# Altium project Reid Orthotic v2.PrjPcb
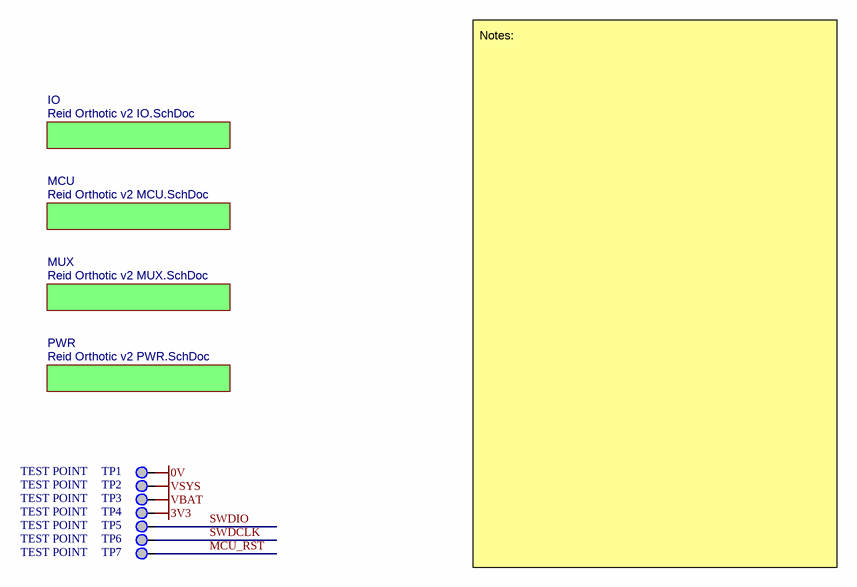
[diagram p0: Reid Orthotic v2.SchDoc]
5 sheets, 127 parts. Net scope: global (net labels, ports and power ports of the same name join across sheets).
Sheets:
  Reid Orthotic v2.SchDoc
    IO = Reid Orthotic v2 IO.SchDoc
    MCU = Reid Orthotic v2 MCU.SchDoc
    MUX = Reid Orthotic v2 MUX.SchDoc
    PWR = Reid Orthotic v2 PWR.SchDoc

## Sheet Reid Orthotic v2.SchDoc: CAL1020
size A4; DrawnBy: Alex Gilmour; DocumentNumber: 1; Revision: v2; SheetNumber: 1; SheetTotal: 5; PageSetup: Record=PageOptions|CenterHorizontal=True|CenterVertical=True|PrintScale=0.73|XCorrection=1.00|YCorrection=1.00|PrintKind=0|BorderSize=5000000|LeftOffset=0|BottomOffset=0|Orientation=2|PaperLength=1000|PaperWidth=1000|Scale=100|PaperSource=7|PrintQuality=-3|MediaType=1|DitherType=10|PrintScaleMode=1|PaperKind=A4|PaperIndex=9

### Parts
TP1  TEST POINT  [TEST POINT 1.0MM]  (no BOM)
TP2  TEST POINT  [TEST POINT 1.0MM]  (no BOM)
TP3  TEST POINT  [TEST POINT 1.0MM]  (no BOM)
TP4  TEST POINT  [TEST POINT 1.0MM]  (no BOM)
TP5  TEST POINT  [TEST POINT 1.0MM]  (no BOM)
TP6  TEST POINT  [TEST POINT 1.0MM]  (no BOM)
TP7  TEST POINT  [TEST POINT 1.0MM]  (no BOM)

### Sub-sheets
IO = Reid Orthotic v2 IO.SchDoc: no entries
MCU = Reid Orthotic v2 MCU.SchDoc: no entries
MUX = Reid Orthotic v2 MUX.SchDoc: no entries
PWR = Reid Orthotic v2 PWR.SchDoc: no entries

### Nets
0V: TP1.TP
3V3: TP4.TP
VBAT: TP3.TP
VSYS: TP2.TP
MCU_RST: TP7.TP
SWDCLK: TP6.TP
SWDIO: TP5.TP

### Notes on the sheet
- Notes:
- A.B.N. 89 367 394 425
- Revision
- Drawn by
- Last updated
- Sheet
- of

## Sheet Reid Orthotic v2 IO.SchDoc: CAL1020 IO
size A4; DrawnBy: Alex Gilmour; DocumentNumber: 2; Revision: v2; SheetNumber: 2; SheetTotal: 5; PageSetup: Record=PageOptions|CenterHorizontal=True|CenterVertical=True|PrintScale=0.73|XCorrection=1.00|YCorrection=1.00|PrintKind=0|BorderSize=5000000|LeftOffset=0|BottomOffset=0|Orientation=2|PaperLength=1000|PaperWidth=1000|Scale=100|PaperSource=7|PrintQuality=-3|MediaType=1|DitherType=10|PrintScaleMode=1|PaperKind=A4|PaperIndex=9
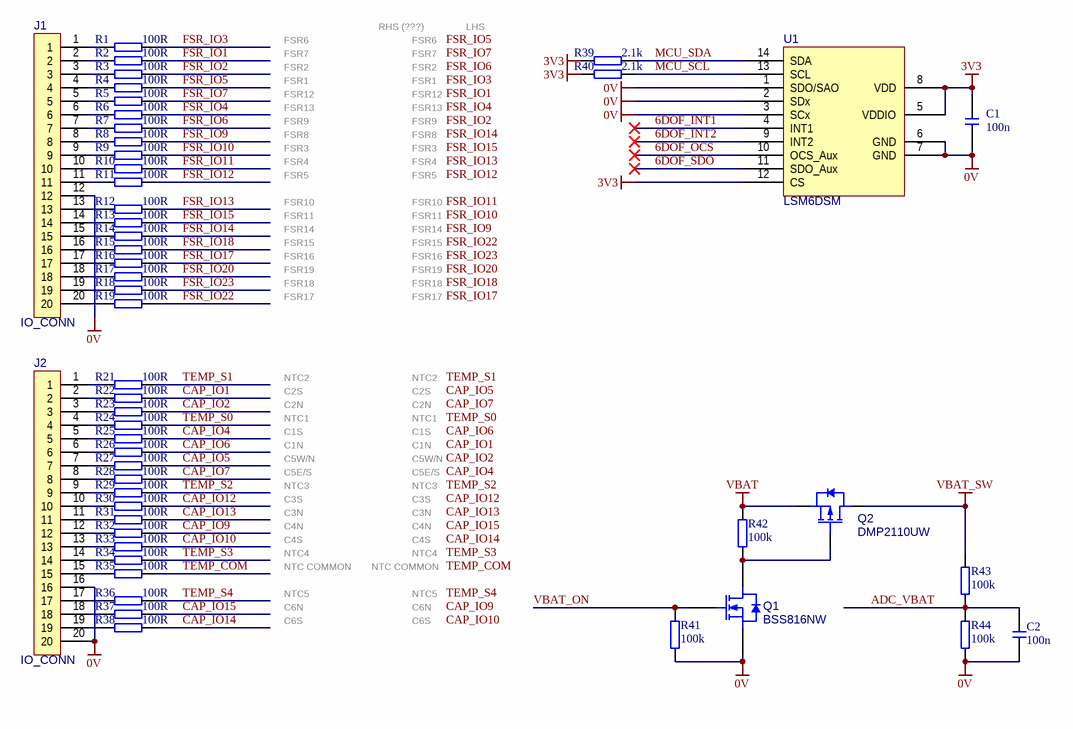
[diagram p1: Reid Orthotic v2 IO.SchDoc]

### Parts
C1  100n  [0402 CAP HD]
C2  100n  [0402 CAP HD]
J1  IO_CONN  [IO_CONN]
J2  IO_CONN  [IO_CONN]
Q1  BSS816NW  [SOT323]
Q2  DMP2110UW  [SOT323]
R1  100R  [0402 RES HD]
R2  100R  [0402 RES HD]
R3  100R  [0402 RES HD]
R4  100R  [0402 RES HD]
R5  100R  [0402 RES HD]
R6  100R  [0402 RES HD]
R7  100R  [0402 RES HD]
R8  100R  [0402 RES HD]
R9  100R  [0402 RES HD]
R10  100R  [0402 RES HD]
R11  100R  [0402 RES HD]
R12  100R  [0402 RES HD]
R13  100R  [0402 RES HD]
R14  100R  [0402 RES HD]
R15  100R  [0402 RES HD]
R16  100R  [0402 RES HD]
R17  100R  [0402 RES HD]
R18  100R  [0402 RES HD]
R19  100R  [0402 RES HD]
R21  100R  [0402 RES HD]
R22  100R  [0402 RES HD]
R23  100R  [0402 RES HD]
R24  100R  [0402 RES HD]
R25  100R  [0402 RES HD]
R26  100R  [0402 RES HD]
R27  100R  [0402 RES HD]
R28  100R  [0402 RES HD]
R29  100R  [0402 RES HD]
R30  100R  [0402 RES HD]
R31  100R  [0402 RES HD]
R32  100R  [0402 RES HD]
R33  100R  [0402 RES HD]
R34  100R  [0402 RES HD]
R35  100R  [0402 RES HD]
R36  100R  [0402 RES HD]
R37  100R  [0402 RES HD]
R38  100R  [0402 RES HD]
R39  2.1k  [0402 RES HD]
R40  2.1k  [0402 RES HD]
R41  100k  [0402 RES HD]
R42  100k  [0402 RES HD]
R43  100k  [0402 RES HD]
R44  100k  [0402 RES HD]
U1  LSM6DSM  [LSM6DSM]

### Nets
0V: C1.1 C2.2 J1.12 J2.16 J2.20 Q1.2(S) R41.2 R44.2 U1.1(SDO/SAO) U1.2(SDx) U1.3(SCx) U1.6(GND) U1.7(GND)
3V3: C1.2 R39.2 R40.2 U1.5(VDDIO) U1.8(VDD) U1.12(CS)
VBAT: Q2.2(S) R42.1
VBAT_SW: Q2.3(D) R43.1
6DOF_INT1: U1.4(INT1)
6DOF_INT2: U1.9(INT2)
6DOF_OCS: U1.10(OCS_Aux)
6DOF_SDO: U1.11(SDO_Aux)
ADC_VBAT: C2.1 R43.2 R44.1
CAP_IO1: R22.1
CAP_IO2: R23.1
CAP_IO4: R25.1
CAP_IO5: R27.1
CAP_IO6: R26.1
CAP_IO7: R28.1
CAP_IO9: R32.1
CAP_IO10: R33.1
CAP_IO12: R30.1
CAP_IO13: R31.1
CAP_IO14: R38.1
CAP_IO15: R37.1
FSR_IO1: R2.1
FSR_IO2: R3.1
FSR_IO3: R1.1
FSR_IO4: R6.1
FSR_IO5: R4.1
FSR_IO6: R7.1
FSR_IO7: R5.1
FSR_IO9: R8.1
FSR_IO10: R9.1
FSR_IO11: R10.1
FSR_IO12: R11.1
FSR_IO13: R12.1
FSR_IO14: R14.1
FSR_IO15: R13.1
FSR_IO17: R16.1
FSR_IO18: R15.1
FSR_IO20: R17.1
FSR_IO22: R19.1
FSR_IO23: R18.1
MCU_SCL: R40.1 U1.13(SCL)
MCU_SDA: R39.1 U1.14(SDA)
TEMP_COM: R35.1
TEMP_S0: R24.1
TEMP_S1: R21.1
TEMP_S2: R29.1
TEMP_S3: R34.1
TEMP_S4: R36.1
VBAT_ON: Q1.1(G) R41.1
NetJ1_1: J1.1 R1.2
NetJ1_2: J1.2 R2.2
NetJ1_3: J1.3 R3.2
NetJ1_4: J1.4 R4.2
NetJ1_5: J1.5 R5.2
NetJ1_6: J1.6 R6.2
NetJ1_7: J1.7 R7.2
NetJ1_8: J1.8 R8.2
NetJ1_9: J1.9 R9.2
NetJ1_10: J1.10 R10.2
NetJ1_11: J1.11 R11.2
NetJ1_13: J1.13 R12.2
NetJ1_14: J1.14 R13.2
NetJ1_15: J1.15 R14.2
NetJ1_16: J1.16 R15.2
NetJ1_17: J1.17 R16.2
NetJ1_18: J1.18 R17.2
NetJ1_19: J1.19 R18.2
NetJ1_20: J1.20 R19.2
NetJ2_1: J2.1 R21.2
NetJ2_2: J2.2 R22.2
NetJ2_3: J2.3 R23.2
NetJ2_4: J2.4 R24.2
NetJ2_5: J2.5 R25.2
NetJ2_6: J2.6 R26.2
NetJ2_7: J2.7 R27.2
NetJ2_8: J2.8 R28.2
NetJ2_9: J2.9 R29.2
NetJ2_10: J2.10 R30.2
NetJ2_11: J2.11 R31.2
NetJ2_12: J2.12 R32.2
NetJ2_13: J2.13 R33.2
NetJ2_14: J2.14 R34.2
NetJ2_15: J2.15 R35.2
NetJ2_17: J2.17 R36.2
NetJ2_18: J2.18 R37.2
NetJ2_19: J2.19 R38.2
NetQ1_3: Q1.3(D) Q2.1(G) R42.2

### Notes on the sheet
- FSR1
- FSR2
- FSR6
- FSR7
- RHS (???)
- LHS
- FSR3
- FSR8
- FSR9
- FSR12
- FSR13
- FSR4
- FSR5
- FSR10
- FSR11
- FSR14
- FSR15
- FSR16
- FSR18
- FSR19
- FSR17
- NTC1
- NTC2
- C2S
- C2N
- NTC3
- C1S
- C1N
- C5W/N
- C5E/S
- NTC4
- C3S
- C3N
- C4N
- C4S
- NTC5
- NTC COMMON
- C6N
- C6S
- Labels drawn without touching a wire or pin: CAP_IO1, CAP_IO2, CAP_IO4, CAP_IO5, CAP_IO6, CAP_IO7, CAP_IO9, CAP_IO10, CAP_IO12, CAP_IO13, CAP_IO14, CAP_IO15, FSR_IO1, FSR_IO2, FSR_IO3, FSR_IO4, FSR_IO5, FSR_IO6, FSR_IO7, FSR_IO9, FSR_IO10, FSR_IO11, FSR_IO12, FSR_IO13, FSR_IO14, FSR_IO15, FSR_IO17, FSR_IO18, FSR_IO20, FSR_IO22, FSR_IO23, TEMP_COM, TEMP_S0, TEMP_S1, TEMP_S2, TEMP_S3, TEMP_S4
- A.B.N. 89 367 394 425
- Revision
- Drawn by
- Last updated
- Sheet
- of

### Library data of the parts
C1 C2 = Capacitor
Q1 = MOSFET N-CH
Q2 = MOSFET PCH
R1-R19 R21-R44 = Resistor

## Sheet Reid Orthotic v2 MCU.SchDoc: CAL1020 MCU
size A4; DrawnBy: Alex Gilmour; DocumentNumber: 3; Revision: v2; SheetNumber: 3; SheetTotal: 5; PageSetup: Record=PageOptions|CenterHorizontal=True|CenterVertical=True|PrintScale=0.73|XCorrection=1.00|YCorrection=1.00|PrintKind=0|BorderSize=5000000|LeftOffset=0|BottomOffset=0|Orientation=2|PaperLength=1000|PaperWidth=1000|Scale=100|PaperSource=7|PrintQuality=-3|MediaType=1|DitherType=10|PrintScaleMode=1|PaperKind=A4|PaperIndex=9
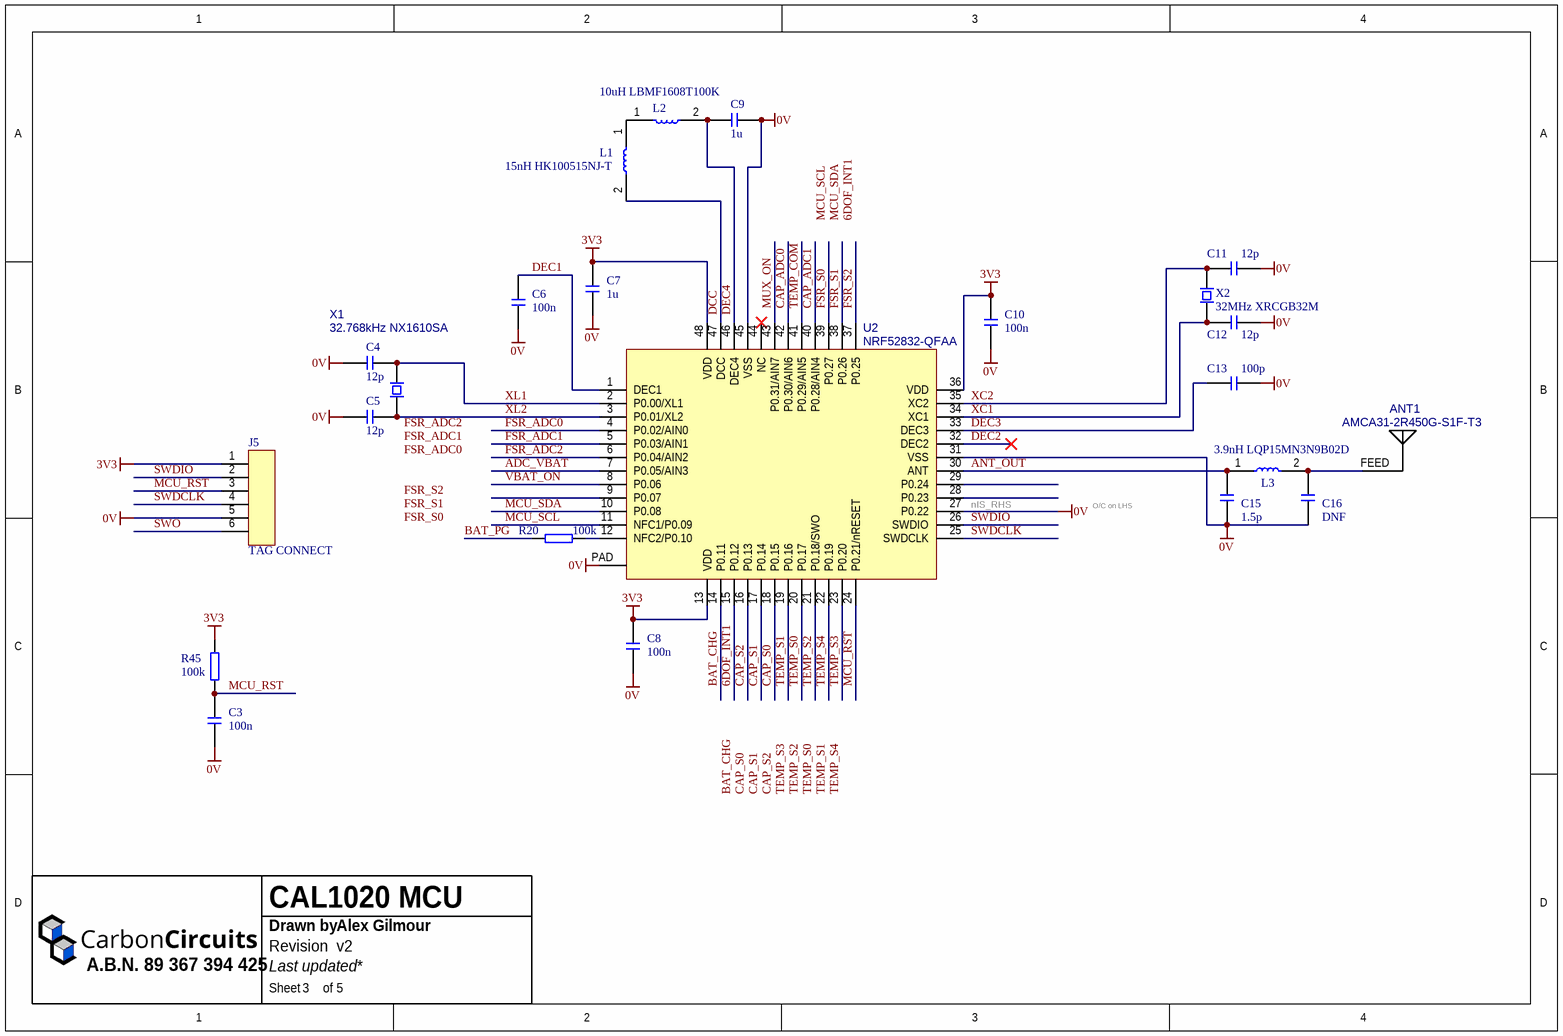
[diagram p2: Reid Orthotic v2 MCU.SchDoc]

### Parts
ANT1  AMCA31-2R450G-S1F-T3  [RFANT3216120A5T]
C3  100n  [0402 CAP HD]
C4  12p  [0402 CAP HD]
C5  12p  [0402 CAP HD]
C6  100n  [0402 CAP HD]
C7  1u  [0402 CAP HD]
C8  100n  [0402 CAP HD]
C9  1u  [0402 CAP HD]
C10  100n  [0402 CAP HD]
C11  12p  [0402 CAP HD]
C12  12p  [0402 CAP HD]
C13  100p  [0402 CAP HD]
C15  1.5p  [0402 CAP HD]
C16  DNF  [0402 CAP HD]
J5  TAG CONNECT  [TC2030-NL]  (no BOM)
L1  15nH HK100515NJ-T  [0402 HD]
L2  10uH LBMF1608T100K  [0603 HD]
L3  3.9nH LQP15MN3N9B02D  [0402 HD]
R20  100k  [0402 RES HD]
R45  100k  [0402 RES HD]
U2  NRF52832-QFAA  [NRF52832-QFAA]
X1  32.768kHz NX1610SA  [CRYSTAL NDK NX1610SA]
X2  32MHz XRCGB32M  [XTAL 2016]

### Nets
0V: C3.1 C4.2 C5.2 C6.1 C7.1 C8.1 C9.1 C10.1 C11.1 C12.1 C13.1 C15.1 C16.1 J5.5 U2.27(P0.22) U2.31(VSS) U2.45(VSS) U2.PAD
3V3: C7.2 C8.2 C10.2 J5.1 R45.2 U2.13(VDD) U2.36(VDD) U2.48(VDD)
6DOF_INT1: U2.15(P0.12)
ADC_VBAT: U2.7(P0.05/AIN3)
ANT_OUT: C15.2 L3.1 U2.30(ANT)
BAT_CHG: U2.14(P0.11)
BAT_PG: R20.2
CAP_ADC0: U2.42(P0.30/AIN6)
CAP_ADC1: U2.40(P0.28/AIN4)
CAP_S0: U2.18(P0.15)
CAP_S1: U2.17(P0.14)
CAP_S2: U2.16(P0.13)
DCC: L1.2 U2.47(DCC)
DEC1: C6.2 U2.1(DEC1)
DEC2: U2.32(DEC2)
DEC3: C13.2 U2.33(DEC3)
DEC4: C9.2 L2.2 U2.46(DEC4)
FSR_ADC0: U2.4(P0.02/AIN0)
FSR_ADC1: U2.5(P0.03/AIN1)
FSR_ADC2: U2.6(P0.04/AIN2)
FSR_S0: U2.39(P0.27)
FSR_S1: U2.38(P0.26)
FSR_S2: U2.37(P0.25)
MCU_RST: C3.2 J5.3 R45.1 U2.24(P0.21/nRESET)
MCU_SCL: U2.11(NFC1/P0.09)
MCU_SDA: U2.10(P0.08)
MUX_ON: U2.43(P0.31/AIN7)
SWDCLK: J5.4 U2.25(SWDCLK)
SWDIO: J5.2 U2.26(SWDIO)
SWO: J5.6
TEMP_COM: U2.41(P0.29/AIN5)
TEMP_S0: U2.20(P0.17)
TEMP_S1: U2.19(P0.16)
TEMP_S2: U2.21(P0.18/SWO)
TEMP_S3: U2.23(P0.20)
TEMP_S4: U2.22(P0.19)
VBAT_ON: U2.8(P0.06)
XC1: C12.2 U2.34(XC1) X2.1
XC2: C11.2 U2.35(XC2) X2.2
XL1: C4.1 U2.2(P0.00/XL1) X1.1
XL2: C5.1 U2.3(P0.01/XL2) X1.2
NetANT1_FEED: ANT1.FEED C16.2 L3.2
NetL1_1: L1.1 L2.1
NetR20_1: R20.1 U2.12(NFC2/P0.10)

Not connected (* = marked no-connect by the designer): U2 9(P0.07) 28(P0.23) 29(P0.24) 44(NC)*

### Notes on the sheet
- (near U2) nIS_RHS
- O/C on LHS
- Labels drawn without touching a wire or pin: 6DOF_INT1, BAT_CHG, CAP_S0, CAP_S1, CAP_S2, FSR_ADC0, FSR_ADC1, FSR_ADC2, FSR_S0, FSR_S1, FSR_S2, MCU_SCL, MCU_SDA, TEMP_S0, TEMP_S1, TEMP_S2, TEMP_S3, TEMP_S4
- A.B.N. 89 367 394 425
- Revision
- Drawn by
- Last updated
- Sheet
- of

### Library data of the parts
ANT1 = Antenna
C3-C13 C15 C16 = Capacitor
J5 = CON 6POS
L1-L3 = Inductor
R20 R45 = Resistor
X1 = Crystal 32.768kHz
X2 = Crystal

## Sheet Reid Orthotic v2 MUX.SchDoc: CAL1020 MCU
size A4; DrawnBy: Alex Gilmour; DocumentNumber: 4; Revision: v2; SheetNumber: 4; SheetTotal: 5; PageSetup: Record=PageOptions|CenterHorizontal=True|CenterVertical=True|PrintScale=0.73|XCorrection=1.00|YCorrection=1.00|PrintKind=0|BorderSize=5000000|LeftOffset=0|BottomOffset=0|Orientation=2|PaperLength=1000|PaperWidth=1000|Scale=100|PaperSource=7|PrintQuality=-3|MediaType=1|DitherType=10|PrintScaleMode=1|PaperKind=A4|PaperIndex=9
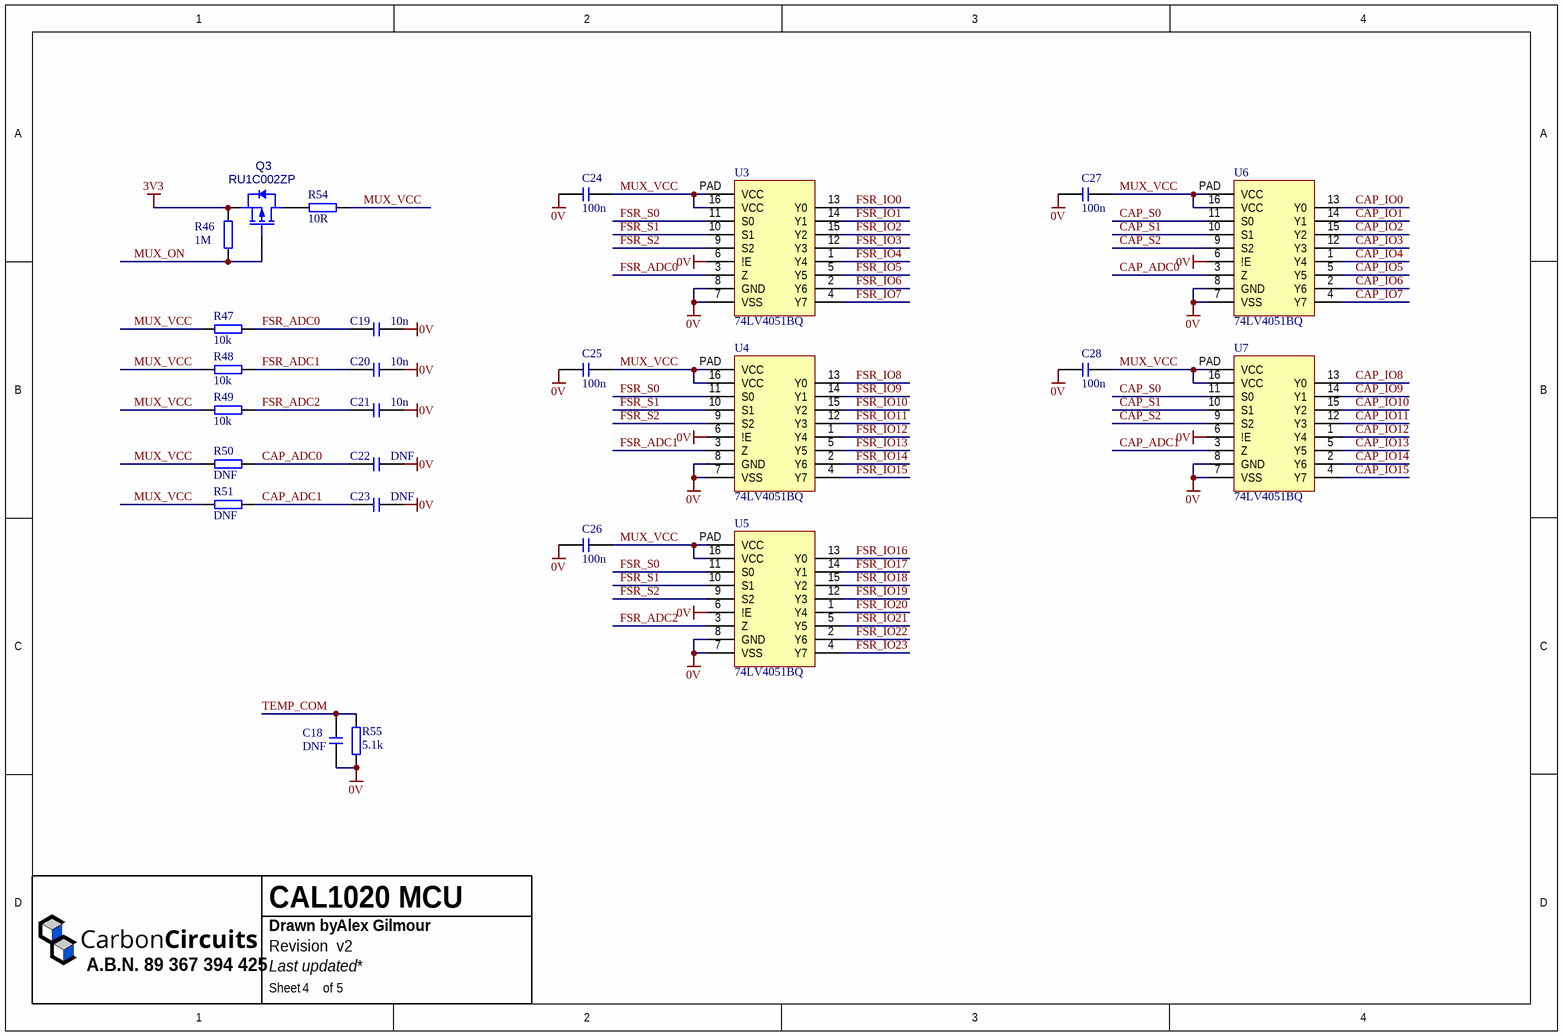
[diagram p3: Reid Orthotic v2 MUX.SchDoc]

### Parts
C18  DNF  [0402 CAP HD]
C19  10n  [0402 CAP HD]
C20  10n  [0402 CAP HD]
C21  10n  [0402 CAP HD]
C22  DNF  [0402 CAP HD]
C23  DNF  [0402 CAP HD]
C24  100n  [0402 CAP HD]
C25  100n  [0402 CAP HD]
C26  100n  [0402 CAP HD]
C27  100n  [0402 CAP HD]
C28  100n  [0402 CAP HD]
Q3  RU1C002ZP  [SOT323]
R46  1M  [0402 RES HD]
R47  10k  [0402 RES HD]
R48  10k  [0402 RES HD]
R49  10k  [0402 RES HD]
R50  DNF  [0402 RES HD]
R51  DNF  [0402 RES HD]
R54  10R  [0603 RES HD]
R55  5.1k  [0402 RES HD]
U3  74LV4051BQ  [74LV4051BQ]
U4  74LV4051BQ  [74LV4051BQ]
U5  74LV4051BQ  [74LV4051BQ]
U6  74LV4051BQ  [74LV4051BQ]
U7  74LV4051BQ  [74LV4051BQ]

### Nets
0V: C18.2 C19.2 C20.2 C21.2 C22.2 C23.2 C24.1 C25.1 C26.1 C27.1 C28.1 R55.2 U3.6(!E) U3.7(VSS) U3.8(GND) U4.6(!E) U4.7(VSS) U4.8(GND) U5.6(!E) U5.7(VSS) U5.8(GND) U6.6(!E) U6.7(VSS) U6.8(GND) U7.6(!E) U7.7(VSS) U7.8(GND)
3V3: Q3.2(S) R46.2
CAP_ADC0: C22.1 R50.1 U6.3(Z)
CAP_ADC1: C23.1 R51.1 U7.3(Z)
CAP_IO0: U6.13(Y0)
CAP_IO1: U6.14(Y1)
CAP_IO2: U6.15(Y2)
CAP_IO3: U6.12(Y3)
CAP_IO4: U6.1(Y4)
CAP_IO5: U6.5(Y5)
CAP_IO6: U6.2(Y6)
CAP_IO7: U6.4(Y7)
CAP_IO8: U7.13(Y0)
CAP_IO9: U7.14(Y1)
CAP_IO10: U7.15(Y2)
CAP_IO11: U7.12(Y3)
CAP_IO12: U7.1(Y4)
CAP_IO13: U7.5(Y5)
CAP_IO14: U7.2(Y6)
CAP_IO15: U7.4(Y7)
CAP_S0: U6.11(S0) U7.11(S0)
CAP_S1: U6.10(S1) U7.10(S1)
CAP_S2: U6.9(S2) U7.9(S2)
FSR_ADC0: C19.1 R47.1 U3.3(Z)
FSR_ADC1: C20.1 R48.1 U4.3(Z)
FSR_ADC2: C21.1 R49.1 U5.3(Z)
FSR_IO0: U3.13(Y0)
FSR_IO1: U3.14(Y1)
FSR_IO2: U3.15(Y2)
FSR_IO3: U3.12(Y3)
FSR_IO4: U3.1(Y4)
FSR_IO5: U3.5(Y5)
FSR_IO6: U3.2(Y6)
FSR_IO7: U3.4(Y7)
FSR_IO8: U4.13(Y0)
FSR_IO9: U4.14(Y1)
FSR_IO10: U4.15(Y2)
FSR_IO11: U4.12(Y3)
FSR_IO12: U4.1(Y4)
FSR_IO13: U4.5(Y5)
FSR_IO14: U4.2(Y6)
FSR_IO15: U4.4(Y7)
FSR_IO16: U5.13(Y0)
FSR_IO17: U5.14(Y1)
FSR_IO18: U5.15(Y2)
FSR_IO19: U5.12(Y3)
FSR_IO20: U5.1(Y4)
FSR_IO21: U5.5(Y5)
FSR_IO22: U5.2(Y6)
FSR_IO23: U5.4(Y7)
FSR_S0: U3.11(S0) U4.11(S0) U5.11(S0)
FSR_S1: U3.10(S1) U4.10(S1) U5.10(S1)
FSR_S2: U3.9(S2) U4.9(S2) U5.9(S2)
MUX_ON: Q3.1(G) R46.1
MUX_VCC: C24.2 C25.2 C26.2 C27.2 C28.2 R47.2 R48.2 R49.2 R50.2 R51.2 R54.1 U3.16(VCC) U3.PAD(VCC) U4.16(VCC) U4.PAD(VCC) U5.16(VCC) U5.PAD(VCC) U6.16(VCC) U6.PAD(VCC) U7.16(VCC) U7.PAD(VCC)
TEMP_COM: C18.1 R55.1
NetQ3_3: Q3.3(D) R54.2

### Notes on the sheet
- A.B.N. 89 367 394 425
- Revision
- Drawn by
- Last updated
- Sheet
- of

### Library data of the parts
C18-C28 = Capacitor
Q3 = MOSFET PCH
R46-R51 R54 R55 = Resistor

## Sheet Reid Orthotic v2 PWR.SchDoc: CAL1020 PWR
size A4; DrawnBy: Alex Gilmour; DocumentNumber: 5; Revision: v2; SheetNumber: 5; SheetTotal: 5; PageSetup: Record=PageOptions|CenterHorizontal=True|CenterVertical=True|PrintScale=0.73|XCorrection=1.00|YCorrection=1.00|PrintKind=0|BorderSize=5000000|LeftOffset=0|BottomOffset=0|Orientation=2|PaperLength=1000|PaperWidth=1000|Scale=100|PaperSource=7|PrintQuality=-3|MediaType=1|DitherType=10|PrintScaleMode=1|PaperKind=A4|PaperIndex=9
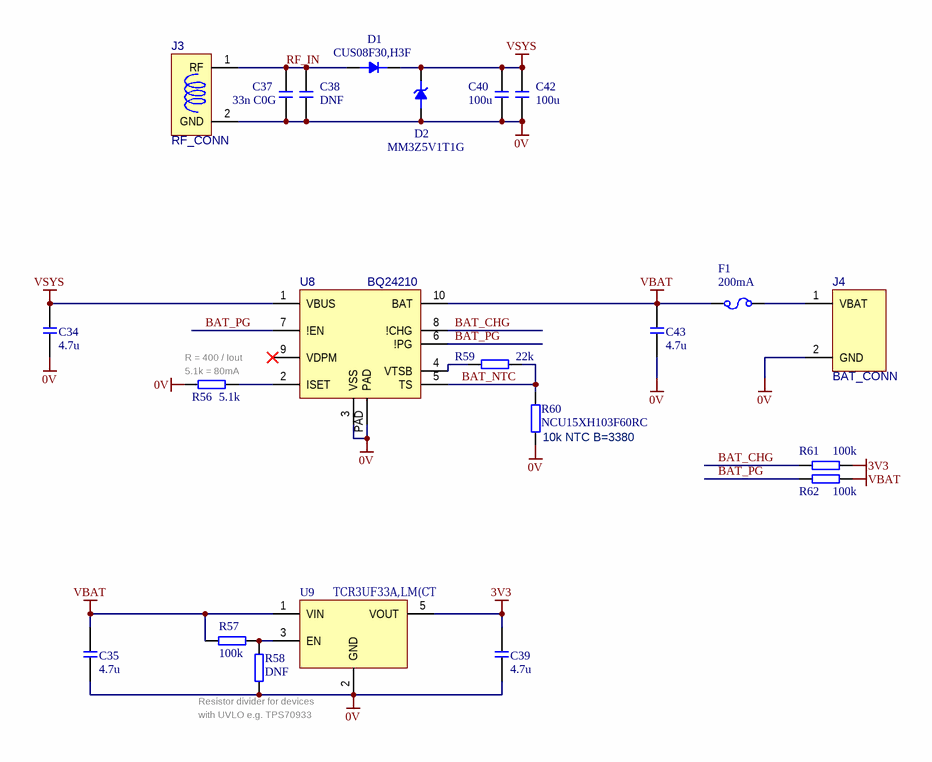
[diagram p4: Reid Orthotic v2 PWR.SchDoc]

### Parts
C34  4.7u  [0603 CAP HD]
C35  4.7u  [0603 CAP HD]
C37  33n C0G  [0805 CAP]
C38  DNF  [0805 CAP]
C39  4.7u  [0603 CAP HD]
C40  100u  [0805 CAP]
C42  100u  [0805 CAP]
C43  4.7u  [0603 CAP HD]
D1  CUS08F30,H3F  [SOD-323]
D2  MM3Z5V1T1G  [SOD-323]
F1  200mA  [0603 FUSE]
J3  RF_CONN  [RF_CONN]
J4  BAT_CONN  [BAT_CONN]
R56  5.1k  [0402 RES HD]
R57  100k  [0402 RES HD]
R58  DNF  [0402 RES HD]
R59  22k  [0402 RES HD]
R60  NCU15XH103F60RC  [0402 RES HD]
R61  100k  [0402 RES HD]
R62  100k  [0402 RES HD]
U8  BQ24210  [BQ24210]
U9  ‎TCR3UF33A,LM(CT  [SOT23-5]

### Nets
0V: C34.1 C35.1 C37.1 C38.1 C39.1 C40.1 C42.1 C43.1 D2.A J3.2(GND) J4.2(GND) R56.2 R58.2 R60.1 U8.3(VSS) U8.PAD U9.2(GND)
3V3: C39.2 R61.1 U9.5(VOUT)
VBAT: C35.2 C43.2 F1.2 R57.2 R62.1 U8.10(BAT) U9.1(VIN)
VSYS: C34.2 C40.2 C42.2 D1.K D2.K U8.1(VBUS)
BAT_CHG: R61.2 U8.8(!CHG)
BAT_NTC: R59.2 R60.2 U8.5(TS)
BAT_PG: R62.2 U8.6(!PG) U8.7(!EN)
RF_IN: C37.2 C38.2 D1.A J3.1(RF)
NetF1_1: F1.1 J4.1(VBAT)
NetR56_1: R56.1 U8.2(ISET)
NetR57_1: R57.1 R58.1 U9.3(EN)
NetR59_1: R59.1 U8.4(VTSB)

Not connected (* = marked no-connect by the designer): U8 9(VDPM)*

### Notes on the sheet
- (near R56) 5.1k = 80mA
- (near R56) R = 400 / Iout
- (near R60) 10k NTC B=3380
- (near R58) Resistor divider for devices
- with UVLO e.g. TPS70933
- A.B.N. 89 367 394 425
- Revision
- Drawn by
- Last updated
- Sheet
- of

### Library data of the parts
C34 C35 C37-C40 C42 C43 = Capacitor
D1 = Diode
D2 = Diode Zener
F1 = Fuse
R56-R62 = Resistor
U9 = MIC5504-x.xYM5

## Nets that join several sheets
0V: Reid Orthotic v2 (TP1.TP), Reid Orthotic v2 IO (13 pins), Reid Orthotic v2 MCU (18 pins), Reid Orthotic v2 MUX (27 pins), Reid Orthotic v2 PWR (17 pins)
3V3: Reid Orthotic v2 (TP4.TP), Reid Orthotic v2 IO (6 pins), Reid Orthotic v2 MCU (8 pins), Reid Orthotic v2 MUX (Q3.2 R46.2), Reid Orthotic v2 PWR (C39.2 R61.1 U9.5)
VBAT: Reid Orthotic v2 (TP3.TP), Reid Orthotic v2 IO (Q2.2 R42.1), Reid Orthotic v2 PWR (7 pins)
VSYS: Reid Orthotic v2 (TP2.TP), Reid Orthotic v2 PWR (6 pins)
6DOF_INT1: Reid Orthotic v2 IO (U1.4), Reid Orthotic v2 MCU (U2.15)
ADC_VBAT: Reid Orthotic v2 IO (C2.1 R43.2 R44.1), Reid Orthotic v2 MCU (U2.7)
BAT_CHG: Reid Orthotic v2 MCU (U2.14), Reid Orthotic v2 PWR (R61.2 U8.8)
BAT_PG: Reid Orthotic v2 MCU (R20.2), Reid Orthotic v2 PWR (R62.2 U8.6 U8.7)
CAP_ADC0: Reid Orthotic v2 MCU (U2.42), Reid Orthotic v2 MUX (C22.1 R50.1 U6.3)
CAP_ADC1: Reid Orthotic v2 MCU (U2.40), Reid Orthotic v2 MUX (C23.1 R51.1 U7.3)
CAP_IO1: Reid Orthotic v2 IO (R22.1), Reid Orthotic v2 MUX (U6.14)
CAP_IO2: Reid Orthotic v2 IO (R23.1), Reid Orthotic v2 MUX (U6.15)
CAP_IO4: Reid Orthotic v2 IO (R25.1), Reid Orthotic v2 MUX (U6.1)
CAP_IO5: Reid Orthotic v2 IO (R27.1), Reid Orthotic v2 MUX (U6.5)
CAP_IO6: Reid Orthotic v2 IO (R26.1), Reid Orthotic v2 MUX (U6.2)
CAP_IO7: Reid Orthotic v2 IO (R28.1), Reid Orthotic v2 MUX (U6.4)
CAP_IO9: Reid Orthotic v2 IO (R32.1), Reid Orthotic v2 MUX (U7.14)
CAP_IO10: Reid Orthotic v2 IO (R33.1), Reid Orthotic v2 MUX (U7.15)
CAP_IO12: Reid Orthotic v2 IO (R30.1), Reid Orthotic v2 MUX (U7.1)
CAP_IO13: Reid Orthotic v2 IO (R31.1), Reid Orthotic v2 MUX (U7.5)
CAP_IO14: Reid Orthotic v2 IO (R38.1), Reid Orthotic v2 MUX (U7.2)
CAP_IO15: Reid Orthotic v2 IO (R37.1), Reid Orthotic v2 MUX (U7.4)
CAP_S0: Reid Orthotic v2 MCU (U2.18), Reid Orthotic v2 MUX (U6.11 U7.11)
CAP_S1: Reid Orthotic v2 MCU (U2.17), Reid Orthotic v2 MUX (U6.10 U7.10)
CAP_S2: Reid Orthotic v2 MCU (U2.16), Reid Orthotic v2 MUX (U6.9 U7.9)
FSR_ADC0: Reid Orthotic v2 MCU (U2.4), Reid Orthotic v2 MUX (C19.1 R47.1 U3.3)
FSR_ADC1: Reid Orthotic v2 MCU (U2.5), Reid Orthotic v2 MUX (C20.1 R48.1 U4.3)
FSR_ADC2: Reid Orthotic v2 MCU (U2.6), Reid Orthotic v2 MUX (C21.1 R49.1 U5.3)
FSR_IO1: Reid Orthotic v2 IO (R2.1), Reid Orthotic v2 MUX (U3.14)
FSR_IO2: Reid Orthotic v2 IO (R3.1), Reid Orthotic v2 MUX (U3.15)
FSR_IO3: Reid Orthotic v2 IO (R1.1), Reid Orthotic v2 MUX (U3.12)
FSR_IO4: Reid Orthotic v2 IO (R6.1), Reid Orthotic v2 MUX (U3.1)
FSR_IO5: Reid Orthotic v2 IO (R4.1), Reid Orthotic v2 MUX (U3.5)
FSR_IO6: Reid Orthotic v2 IO (R7.1), Reid Orthotic v2 MUX (U3.2)
FSR_IO7: Reid Orthotic v2 IO (R5.1), Reid Orthotic v2 MUX (U3.4)
FSR_IO9: Reid Orthotic v2 IO (R8.1), Reid Orthotic v2 MUX (U4.14)
FSR_IO10: Reid Orthotic v2 IO (R9.1), Reid Orthotic v2 MUX (U4.15)
FSR_IO11: Reid Orthotic v2 IO (R10.1), Reid Orthotic v2 MUX (U4.12)
FSR_IO12: Reid Orthotic v2 IO (R11.1), Reid Orthotic v2 MUX (U4.1)
FSR_IO13: Reid Orthotic v2 IO (R12.1), Reid Orthotic v2 MUX (U4.5)
FSR_IO14: Reid Orthotic v2 IO (R14.1), Reid Orthotic v2 MUX (U4.2)
FSR_IO15: Reid Orthotic v2 IO (R13.1), Reid Orthotic v2 MUX (U4.4)
FSR_IO17: Reid Orthotic v2 IO (R16.1), Reid Orthotic v2 MUX (U5.14)
FSR_IO18: Reid Orthotic v2 IO (R15.1), Reid Orthotic v2 MUX (U5.15)
FSR_IO20: Reid Orthotic v2 IO (R17.1), Reid Orthotic v2 MUX (U5.1)
FSR_IO22: Reid Orthotic v2 IO (R19.1), Reid Orthotic v2 MUX (U5.2)
FSR_IO23: Reid Orthotic v2 IO (R18.1), Reid Orthotic v2 MUX (U5.4)
FSR_S0: Reid Orthotic v2 MCU (U2.39), Reid Orthotic v2 MUX (U3.11 U4.11 U5.11)
FSR_S1: Reid Orthotic v2 MCU (U2.38), Reid Orthotic v2 MUX (U3.10 U4.10 U5.10)
FSR_S2: Reid Orthotic v2 MCU (U2.37), Reid Orthotic v2 MUX (U3.9 U4.9 U5.9)
MCU_RST: Reid Orthotic v2 (TP7.TP), Reid Orthotic v2 MCU (C3.2 J5.3 R45.1 U2.24)
MCU_SCL: Reid Orthotic v2 IO (R40.1 U1.13), Reid Orthotic v2 MCU (U2.11)
MCU_SDA: Reid Orthotic v2 IO (R39.1 U1.14), Reid Orthotic v2 MCU (U2.10)
MUX_ON: Reid Orthotic v2 MCU (U2.43), Reid Orthotic v2 MUX (Q3.1 R46.1)
SWDCLK: Reid Orthotic v2 (TP6.TP), Reid Orthotic v2 MCU (J5.4 U2.25)
SWDIO: Reid Orthotic v2 (TP5.TP), Reid Orthotic v2 MCU (J5.2 U2.26)
TEMP_COM: Reid Orthotic v2 IO (R35.1), Reid Orthotic v2 MCU (U2.41), Reid Orthotic v2 MUX (C18.1 R55.1)
TEMP_S0: Reid Orthotic v2 IO (R24.1), Reid Orthotic v2 MCU (U2.20)
TEMP_S1: Reid Orthotic v2 IO (R21.1), Reid Orthotic v2 MCU (U2.19)
TEMP_S2: Reid Orthotic v2 IO (R29.1), Reid Orthotic v2 MCU (U2.21)
TEMP_S3: Reid Orthotic v2 IO (R34.1), Reid Orthotic v2 MCU (U2.23)
TEMP_S4: Reid Orthotic v2 IO (R36.1), Reid Orthotic v2 MCU (U2.22)
VBAT_ON: Reid Orthotic v2 IO (Q1.1 R41.1), Reid Orthotic v2 MCU (U2.8)